# EAGLE design MCU (EAGLE 6.4)
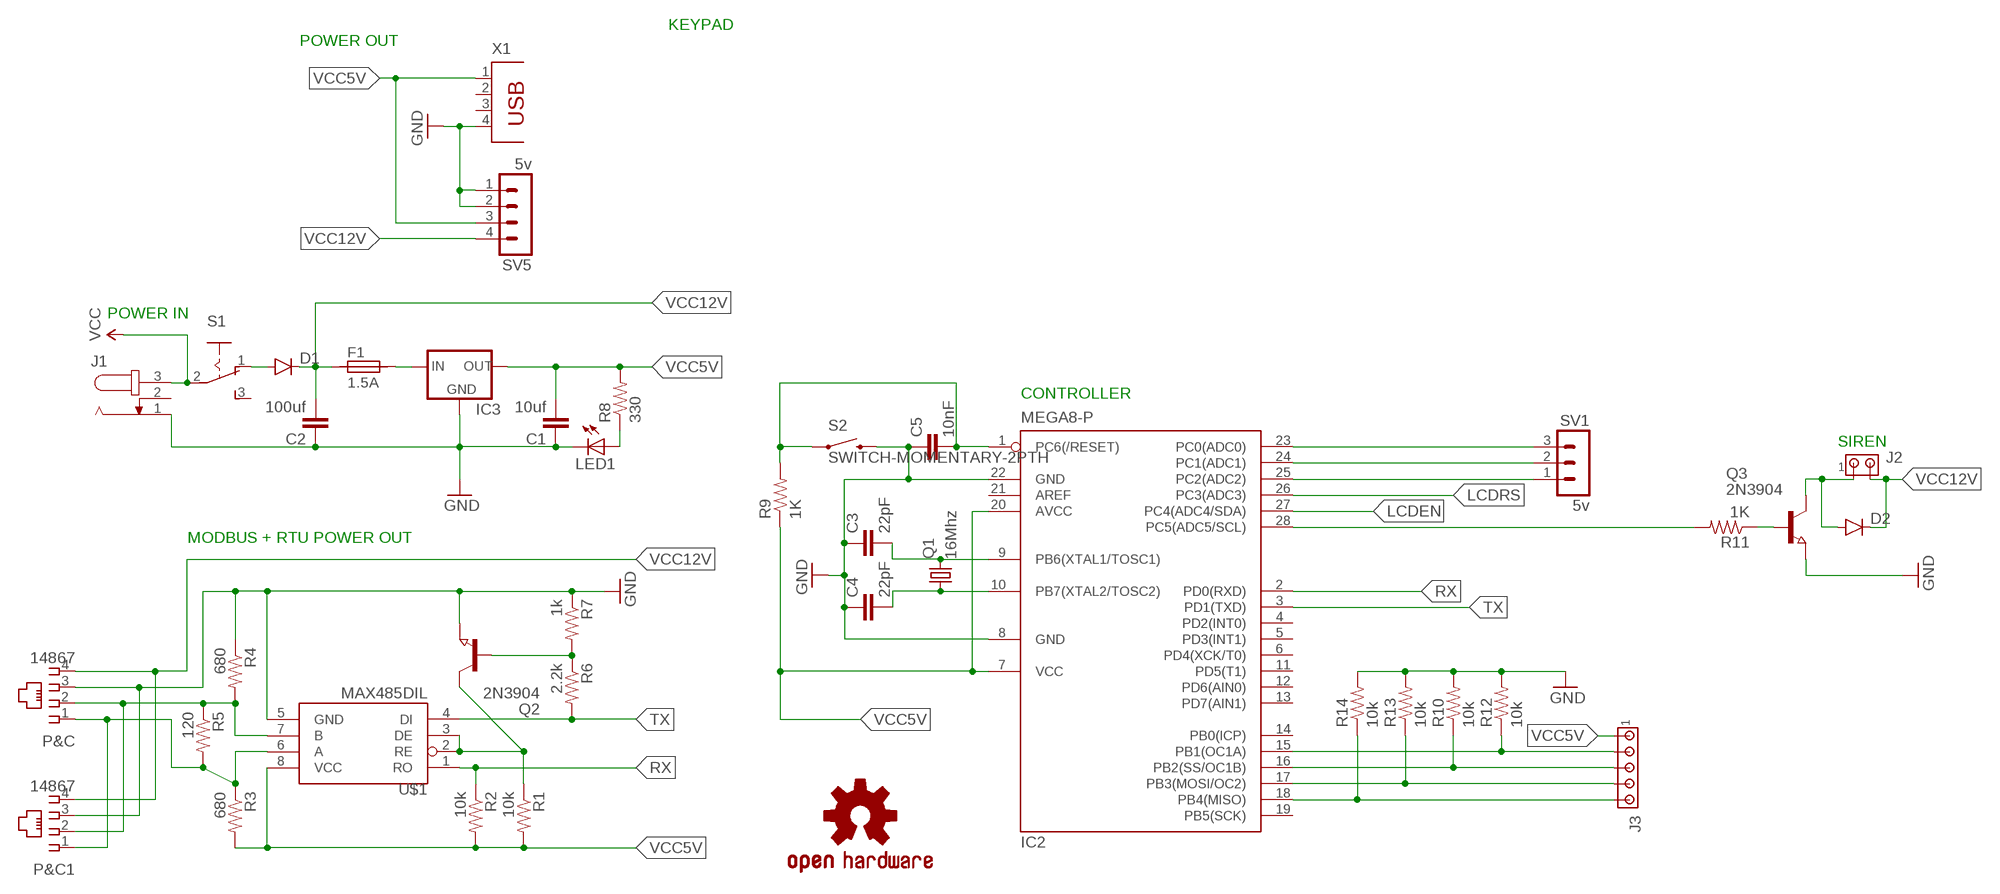
[diagram p0: schematic, sheet 1]

## Parts
C1  10uf  CAP0805  [0805]
C2  100uf  CAP0805  [0805]
C3  22pF  CAP0805  [0805]
C4  22pF  CAP0805  [0805]
C5  10nF  CAP0805  [0805]
D1  DIODESMA  [SMA-DIODE]
D2  DIODESMA  [SMA-DIODE]
F1  1.5A  SIBA194600  [1820]
IC2  MEGA8-P  [DIL28-3]
IC3  V_REG_78XX-TO-220  [TO-220-ALT]
J1  JACK-PLUG1  [SPC4078]
J2  MTA02-156  [1X2MTA]
J3  MTA05-156  [1X5MTA]
LED1  LEDCHIP-LED0805  [CHIP-LED0805]
LOGO1  OSHW-LOGOL  [OSHW-LOGO-L]
P&C  14867  [14867]
P&C1  14867  [14867]
Q1  16Mhz  CRYSTALSM49  [SM49]
Q2  2N3904  NPN-TRANSISTOR_SOT23  [SOT23]
Q3  2N3904  NPN-TRANSISTOR_SOT23  [SOT23]
R1  10k  RESISTOR0805-RES  [0805]
R2  10k  RESISTOR0805-RES  [0805]
R3  680  RESISTOR0805-RES  [0805]
R4  680  RESISTOR0805-RES  [0805]
R5  120  RESISTOR0805-RES  [0805]
R6  2.2k  RESISTOR0805-RES  [0805]
R7  1k  RESISTOR0805-RES  [0805]
R8  330  RESISTOR0805-RES  [0805]
R9  1K  RESISTOR0805-RES  [0805]
R10  10k  RESISTOR0805-RES  [0805]
R11  1K  RESISTOR0805-RES  [0805]
R12  10k  RESISTOR0805-RES  [0805]
R13  10k  RESISTOR0805-RES  [0805]
R14  10k  RESISTOR0805-RES  [0805]
S1  255SB  [255SB]
S2  SWITCH-MOMENTARY-2PTH  [TACTILE-PTH]
SV1  5v  MA03-1  [MA03-1]
SV5  5v  MA04-1  [MA04-1]
U$1  MAX485DIL  [DIL08]
X1  PN87520  [PN87520]

## Nets
GND: C1.1 C2.1 C3.1 C4.1 C5.1 IC2.8(GND) IC2.22(GND) IC3.GND J1.1 LED1.C P&C1.3 P&C.3 Q2.2(E) Q3.2(E) R4.1 R7.1 R10.2 R12.2 R13.2 R14.2 S2.3 SV5.1 SV5.2 U$1.5(GND) X1.4
LCDEN: IC2.27(PC4(ADC4/SDA))
LCDRS: IC2.26(PC3(ADC3))
N$1: F1.2 IC3.IN
N$2: Q2.3(C) R1.1 U$1.2(RE) U$1.3(DE)
N$4: Q2.1(B) R6.1 R7.2
N$5: D2.A J2.1 Q3.3(C)
N$6: Q3.1(B) R11.1
N$7: P&C1.2 P&C.2 R4.2 R5.1 U$1.7(B)
N$8: P&C1.1 P&C.1 R3.1 R5.2 U$1.6(A)
N$9: IC2.28(PC5(ADC5/SCL)) R11.2
N$11: LED1.A R8.1
N$13: D1.A S1.1(O)
N$15: IC2.25(PC2(ADC2)) SV1.1
N$16: IC2.24(PC1(ADC1)) SV1.2
N$17: IC2.23(PC0(ADC0)) SV1.3
N$18: IC2.15(PB1(OC1A)) J3.2 R12.1
N$19: IC2.16(PB2(SS/OC1B)) J3.3 R10.1
N$20: IC2.17(PB3(MOSI/OC2)) J3.4 R13.1
N$21: C3.2 IC2.9(PB6(XTAL1/TOSC1)) Q1.2
N$22: IC2.18(PB4(MISO)) J3.5 R14.1
N$23: C4.2 IC2.10(PB7(XTAL2/TOSC2)) Q1.1
N$24: C5.2 IC2.1(PC6(/RESET)) R9.2 S2.1
RX: IC2.2(PD0(RXD)) R2.1 U$1.1(RO)
TX: IC2.3(PD1(TXD)) R6.2 U$1.4(DI)
VCC: J1.3 S1.2(P)
VCC5V: C1.2 IC2.7(VCC) IC2.20(AVCC) IC3.OUT J3.1 R1.2 R2.2 R3.2 R8.2 R9.1 SV5.3 U$1.8(VCC) X1.1
VCC12V: C2.2 D1.C D2.C F1.1 J2.2 P&C1.4 P&C.4 SV5.4
Unconnected: IC2.4(PD2(INT0)) IC2.5(PD3(INT1)) IC2.6(PD4(XCK/T0)) IC2.11(PD5(T1)) IC2.12(PD6(AIN0)) IC2.13(PD7(AIN1)) IC2.14(PB0(ICP)) IC2.19(PB5(SCK)) IC2.21(AREF) J1.2 S1.3(S) X1.2 X1.3

## Notes on the sheet
- KEYPAD
- POWER OUT
- POWER IN
- CONTROLLER
- SIREN
- MODBUS + RTU POWER OUT

## Library data of the parts
C1-C5 = SparkFun-Capacitors:CAP: Capacitor Standard 0603 ceramic capacitor, and 0.1" leaded capacitor.
D1 D2 = SparkFun-DiscreteSemi:DIODE: Diode These are standard reverse protection diodes and small signal diodes. SMA package can handle up to about 1A. SOD-323 can handle about 200mA. What the SOD-323 package when ordering, there are some mfgs out there that are 5-pin packages.
F1 = _hhn_PtcFuses_Siba_r500_Ozan:SIBA194600*: SIBA PTC-Fuses, Series 194600, 1812 (4.5 3.2)mm Source: www.siba.de/ Package: SMD 1812 (4.5 x 3.2)mm Technologies: SIBA194600Axxx xxx: Trip-Current * 10 mA Author: Dipl.-Ing. FH Rainer Bayer
IC2 = atmel:MEGA8-P: MICROCONTROLLER 8 Kbytes FLASH, 1 kbytes SRAM, 512 bytes EEPROM, USART, 4-channel 10 bit ADC, 2-channel 8 bit ADC Pin compatible with Atmega48, ATMega88, ATMega168 Source: avr.lbr; OC_FARNELL: unknown; OC_NEWARK: unknown
IC3 = SparkFun-PowerIC:V_REG_78XX: Voltage Regulator Standard 7805 5V regulator. IGO (Input Ground Output). Spark Fun Electronics SKU : COM-00107
J1 = con-jack:JACK-PLUG: DC POWER JACK Power Jack, DC, Right Angle, Through Hole, Rated 5A at 16VDC, PC Terminals Distributor: Farnell (www.Farnell.de) Drawing: 84N1161.pdf / 84N1162.pdf Manufacturer: SPC Technology (www.spctechnology.com) Type: SPC4077 / SPC 4078; OC_FARNELL: unknown; OC_NEWARK: unknown
J2 = con-amp:MTA02-156: AMP connector
J3 = con-amp:MTA05-156: AMP connector
LED1 = led:LED: LED OSRAM: - CHIPLED LG R971, LG N971, LY N971, LG Q971, LY Q971, LO R971, LY R971 LH N974, LH R974 LS Q976, LO Q976, LY Q976 LO Q996 - Hyper CHIPLED LW Q18S LB Q993, LB Q99A, LB R99A - SideLED LS A670, LO A670, LY A670, LG A670, LP A670 LB A673, LV A673, LT A673, LW A673 LH A674 LY A675 LS A676, LA A676, LO A676, LY A676, LW A676 LS A679, LY A679, LG A679 - Hyper Micro SIDELED® LS Y876, LA Y876, LO Y876, LY Y876 LT Y87S - SmartLED LW L88C, LW L88S LB L89C, LB L89S, LG L890 LS L89K, LO L89K, LY L89K LS L896, LA L896, LO L896, LY L896 - TOPLED LS T670, LO T670, LY T670, LG T670, LP T670 LSG T670, LSP T670, LSY T670, LOP T670, LYG T670 LG T671, LOG T671, LSG T671 LB T673, LV T673, LT T673, LW T673 LH T674 LS T676, LA T676, LO T676, LY T676, LB T676, LH T676, LSB T676, LW T676 LB T67C, LV T67C, LT T67C, LS T67K, LO T67K, LY T67K, LW E67C LS E67B, LA E67B, LO E67B, LY E67B, LB E67C, LV E67C, LT E67C LW T67C LS T679, LY T679, LG T679 LS T770, LO T770, LY T770, LG T770, LP T770 LB T773, LV T773, LT T773, LW T773 LH T774 LS E675, LA E675, LY E675, LS T675 LS T776, LA T776, LO T776, LY T776, LB T776 LHGB T686 LT T68C, LB T68C - Hyper Mini TOPLED® LB M676 - Mini TOPLED Santana® LG M470 LS M47K, LO M47K, LY M47K Source: http://www.osram.convergy.de LUXEON: - LUMILED® LXK2-PW12-R00, LXK2-PW12-S00, LXK2-PW14-U00, LXK2-PW14-V00 LXK2-PM12-R00, LXK2-PM12-S00, LXK2-PM14-U00 LXK2-PE12-Q00, LXK2-PE12-R00, LXK2-PE12-S00, LXK2-PE14-T00, LXK2-PE14-U00 LXK2-PB12-K00, LXK2-PB12-L00, LXK2-PB12-M00, LXK2-PB14-N00, LXK2-PB14-P00, LXK2-PB14-Q00 LXK2-PR12-L00, LXK2-PR12-M00, LXK2-PR14-Q00, LXK2-PR14-R00 LXK2-PD12-Q00, LXK2-PD12-R00, LXK2-PD12-S00 LXK2-PH12-R00, LXK2-PH12-S00 LXK2-PL12-P00, LXK2-PL12-Q00, LXK2-PL12-R00 Source: www.luxeon.com KINGBRIGHT: KA-3528ASYC Source: www.kingbright.com
LOGO1 = SparkFun-Aesthetics:OSHW-LOGO: Open Source Hardware Logo This logo indicates the piece of hardware it is found on incorporates a OSHW license and/or adheres to the definition of open source hardware found here: http://freedomdefined.org/OSHW
P&C P&C1 = con-4ucon:14867: RJ11 Connector Source: 4UCON TECHNOLOGY INC. 14867.pdf; OC_FARNELL: unknown; OC_NEWARK: unknown
Q1 = crystal:CRYSTAL: CRYSTAL; OC_FARNELL: unknown; OC_NEWARK: unknown
Q2 Q3 = semicon-smd-ipc:NPN-TRANSISTOR_: NPN TRANSISTOR
R1-R14 = SparkFun-Passives:RESISTOR: Resistor Basic schematic elements and footprints for 0603, 1206, and PTH resistors.
S1 = switch:255SB: SLIDING SWITCH Distributor Buerklin, 11G810
S2 = SparkFun-Electromechanical:SWITCH-MOMENTARY-2: Various NO switches- pushbuttons, reed, etc
SV1 = con-lstb:MA03-1: PIN HEADER; OC_FARNELL: unknown; OC_NEWARK: unknown
SV5 = con-lstb:MA04-1: PIN HEADER; OC_FARNELL: unknown; OC_NEWARK: unknown
U$1 = SparkFun-DigitalIC:MAX485: RS-485 transceiver
X1 = con-berg:PN87520: BERG USB connector; OC_FARNELL: unknown; OC_NEWARK: unknown

## Net classes
0 default: width 0.3 mm, drill 0.5 mm, clearance 0.25 mm

## Board
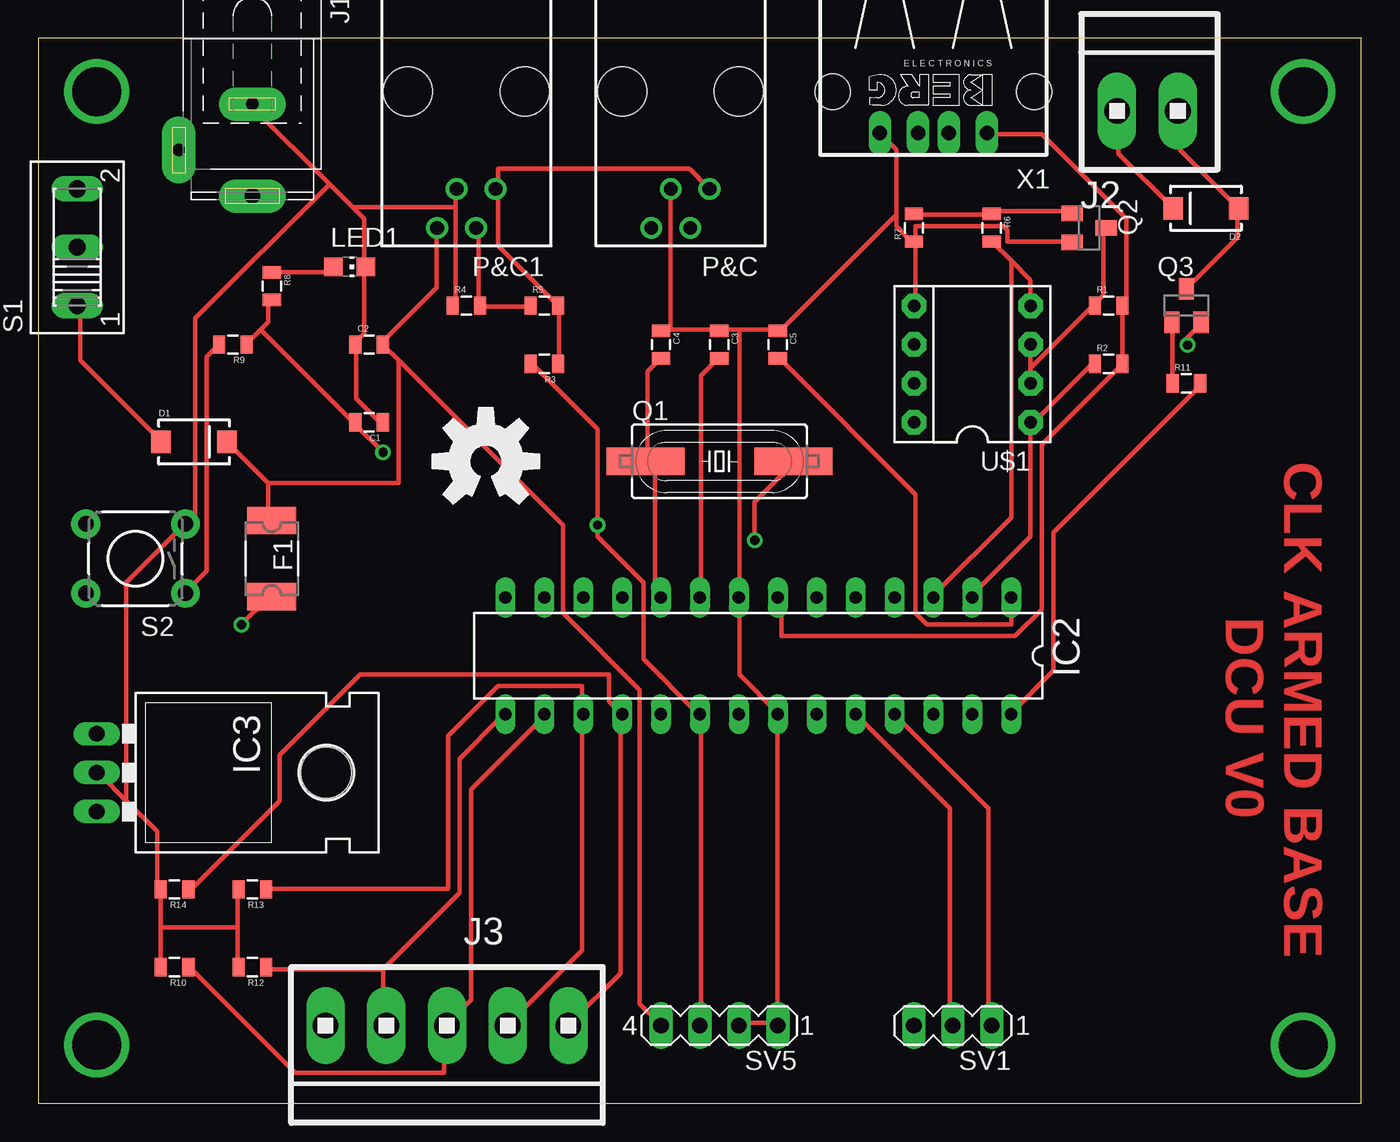
[diagram p1: board, top side]
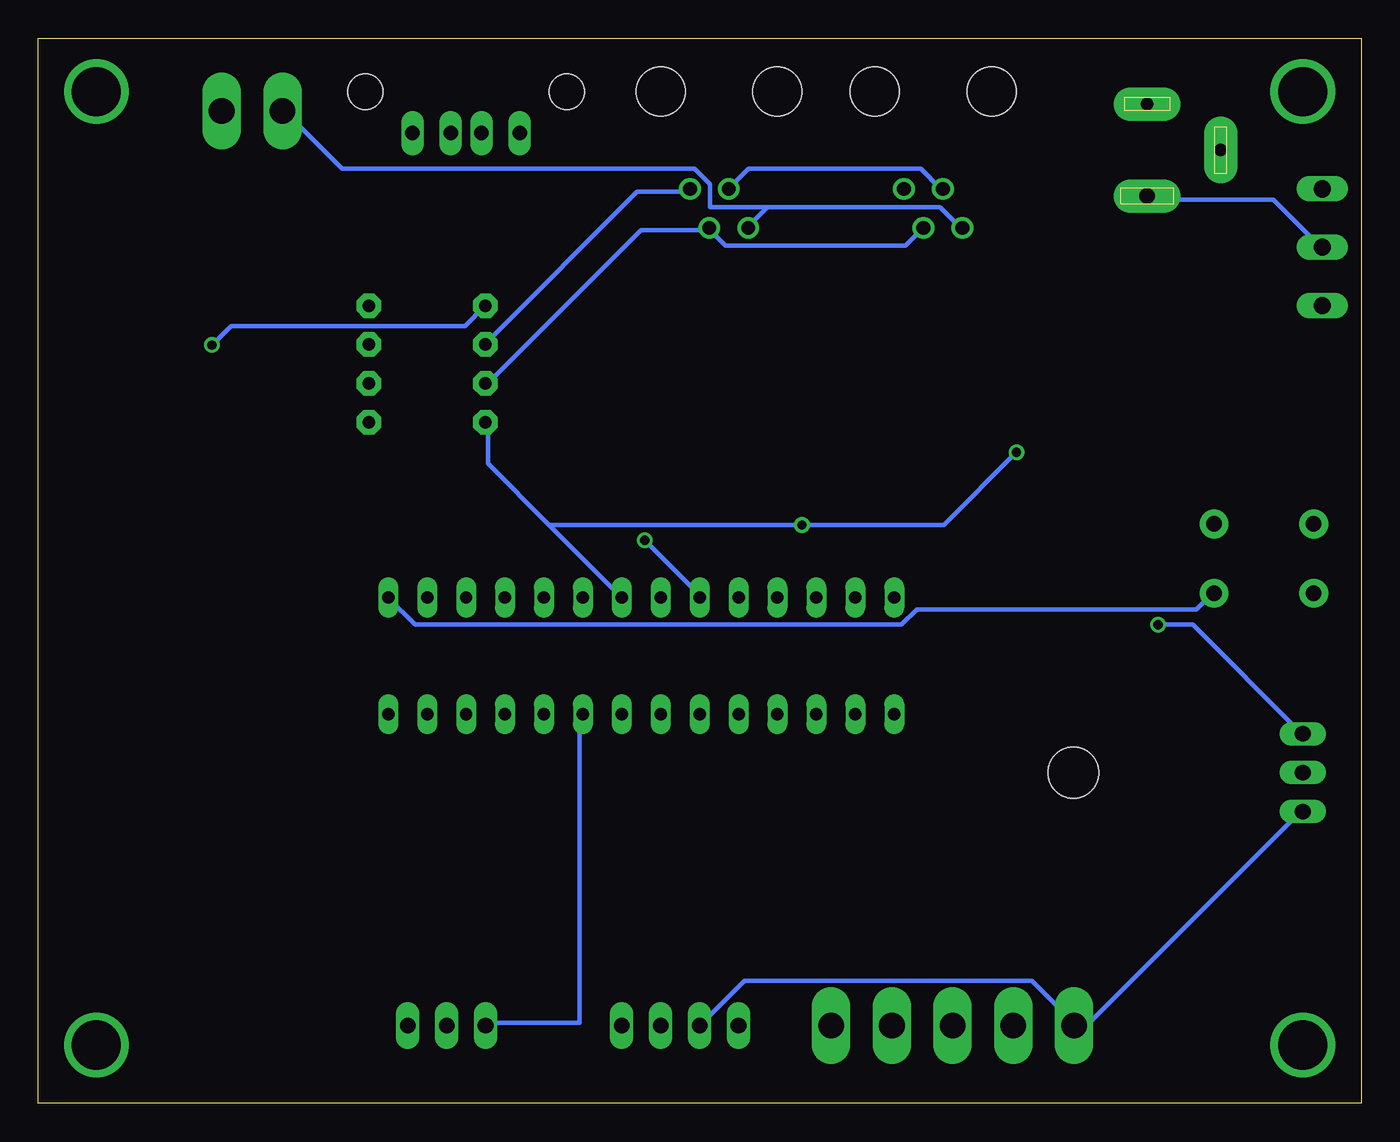
[diagram p2: board, bottom side, seen from below]

Size 86.34 x 69.52 mm. Coordinates in mm from the lower left corner, seen from the top.
Outline: 0,0 86.34,0 86.34,69.52 0,69.52 0,0
Copper layers (1*16): Top 0.035mm / dielectric 1.5mm / Bottom 0.035mm
Design rules "default": minimum track width 10mil, minimum drill 24mil, track to track 8mil, track to pad 8mil, pad to pad 8mil, via to via 8mil, smd to smd 8mil, copper to edge 40mil, drill to drill 8mil, minimum pad ring 10mil, minimum via ring 8mil, stop-mask expansion 4mil, vias tented up to drill 0mil, thermal gap 10mil

### Footprints (pad centres in the part's own frame; a part is rotated, then mirrored left to right if it is on the bottom)
0805 = smd 0.8 x 1.2: 1 -0.9,0; 2 0.9,0
SMA-DIODE = smd 1.27 x 1.47: A -2.15,0; C 2.15,0
1820 = smd 1.78 x 3.2: 1 -2.49,0; 2 2.49,0
DIL28-3 = drill 0.813 long: 1 -16.51,-3.81; 2 -13.97,-3.81; 3 -11.43,-3.81; 4 -8.89,-3.81; 5 -6.35,-3.81; 6 -3.81,-3.81; 7 -1.27,-3.81; 8 1.27,-3.81; 9 3.81,-3.81; 10 6.35,-3.81; 11 8.89,-3.81; 12 11.43,-3.81; 13 13.97,-3.81; 14 16.51,-3.81; 15 16.51,3.81; 16 13.97,3.81; 17 11.43,3.81; 18 8.89,3.81; 19 6.35,3.81; 20 3.81,3.81; 21 1.27,3.81; 22 -1.27,3.81; 23 -3.81,3.81; 24 -6.35,3.81; 25 -8.89,3.81; 26 -11.43,3.81; 27 -13.97,3.81; 28 -16.51,3.81
TO-220-ALT = drill 1.016 long: GND 0,-3.81; IN -2.54,-3.81; OUT 2.54,-3.81 | hole 3.302: 0,11.176
SPC4078 = drill 0.8 pad 2.184 long: 1 -3,0; 2 0,-4.8 | drill 1 pad 2.184 long: 3 3,0
1X2MTA = drill 1.676 long: 1 1.981,0; 2 -1.981,0
1X5MTA = drill 1.676 long: 1 7.925,0; 2 3.962,0; 3 0,0; 4 -3.962,0; 5 -7.925,0
CHIP-LED0805 = smd 1.2 x 1.2: A 0,-1.05; C 0,1.05
14867 = drill 0.9 pad 1.422: 1 -1.905,6.35; 2 -0.635,8.89; 3 0.635,6.35; 4 1.905,8.89 | hole 3.2: -3.81,0; 3.81,0
SM49 = smd 5.08 x 1.778: 1 -4.826,0; 2 4.826,0
SOT23 = smd 1 x 1.4: 1 -0.95,-1.1; 2 0.95,-1.1; 3 0,1.1
255SB = drill 1.118 long: 1 -3.81,0; 2 0,0; 3 3.81,0
TACTILE-PTH = drill 1.016 pad 1.88: 1 -3.251,2.261; 2 3.251,2.261; 3 -3.251,-2.261; 4 3.251,-2.261
MA03-1 = drill 1.016 long: 1 -2.54,0; 2 0,0; 3 2.54,0
MA04-1 = drill 1.016 long: 1 -3.81,0; 2 -1.27,0; 3 1.27,0; 4 3.81,0
DIL08 = drill 0.813 pad 1.6 octagon: 1 -3.81,-3.81; 2 -1.27,-3.81; 3 1.27,-3.81; 4 3.81,-3.81; 5 3.81,3.81; 6 1.27,3.81; 7 -1.27,3.81; 8 -3.81,3.81
PN87520 = drill 0.95 long: 1 -3.5,2.71; 2 -1,2.71; 3 1,2.71; 4 3.5,2.71 | hole 2.3: -6.57,0; 6.57,0

### Placement (x,y rotation side)
C1  21.59,44.45 180 top
C2  21.59,49.53 0 top
C3  44.45,49.53 270 top
C4  40.64,49.53 270 top
C5  48.26,49.53 270 top
D1  10.16,43.18 0 top
D2  76.2,58.42 180 top
F1  15.24,35.56 270 top
IC2  46.99,29.21 180 top
IC3  7.62,21.59 270 top
J1  13.97,62.23 270 top
J2  72.39,64.77 0 top
J3  26.67,5.08 180 top
LED1  20.32,54.61 270 top
LOGO1  29.21,41.91 0 top
P&C  41.91,66.04 180 top
P&C1  27.94,66.04 180 top
Q1  44.45,41.91 0 top
Q2  68.58,57.15 270 top
Q3  74.93,52.07 0 top
R1  69.85,52.07 0 top
R2  69.85,48.26 0 top
R3  33.02,48.26 180 top
R4  27.94,52.07 0 top
R5  33.02,52.07 0 top
R6  62.23,57.15 270 top
R7  57.15,57.15 90 top
R8  15.24,53.34 270 top
R9  12.7,49.53 180 top
R10  8.89,8.89 180 top
R11  74.93,46.99 0 top
R12  13.97,8.89 180 top
R13  13.97,13.97 180 top
R14  8.89,13.97 180 top
S1  2.54,55.88 90 top
S2  6.35,35.56 180 top
SV1  59.69,5.08 180 top
SV5  44.45,5.08 180 top
U$1  60.96,48.26 90 top
X1  58.42,66.04 180 top

### Tracks (layer width: path | path; a pad name or v marks a point on that pad's centre or on a via)
GND  (via drill 0.61)
  Top 0.3: 8,11.5 8,13.75 R14.2 7.75,14 7.75,17.75 5.75,19.75 | 8,11.5 8,9 R10.2 | 13,11.5 13,13.75 R13.2 | 13,11.5 13,9 R12.2 | 13,11.5 8,11.5 | 5.75,19.75 4,21.5 IC3.GND | 5.75,19.75 5.75,34 9.5,37.75 S2.3 9.75,38 10.25,38.5 10.25,51.25 19,60 | 27.25,58.5 27.25,59.5 P&C1.3 | 27.25,58.5 27.25,52.25 R4.1 | C1.1 22.25,44.5 20.75,46 20.75,49.5 C2.1 20.75,49.75 21.25,50.25 21.25,54.5 LED1.C 21.25,54.75 21.25,57.75 20.5,58.5 | 20.5,58.5 19,60 | 19,60 14,65 J1.1 | 20.5,58.5 27.25,58.5 | 48.25,5.25 45.75,5.25 SV5.2 | 48.25,5.25 48.25,25.25 IC2.22 48.25,25.5 45.75,28 45.75,33 IC2.8 45.75,33.25 45.75,50.5 | 48.25,5.25 SV5.1 | 41.25,50.5 44.25,50.5 C3.1 44.5,50.5 45.75,50.5 | 41.25,50.5 40.75,50.5 C4.1 | 45.75,50.5 48.25,50.5 C5.1 48.5,50.5 56,58 | 41.25,50.5 41.25,59.5 P&C.3 | 57.25,56.25 57.25,52.25 U$1.5 | 57.25,56.25 57.25,57.25 63,57.25 63.25,57 63.25,56.25 67.25,56.25 Q2.2 | 57.25,56.25 R7.1 57,56.25 56,57.25 56,58 | v75,49.5 75,50 75.75,50.75 Q3.2 | X1.4 56,62.25 56,58
  Bottom 0.3: v75,49.5 73.75,50.75 58.5,50.75 57.25,52 U$1.5 | P&C1.3 27.5,59.75 28.75,61 40,61 41.25,59.75 P&C.3
N$1  (via drill 0.61)
  Top 0.3: v13.25,31.25 15,33 F1.2
  Bottom 0.3: v13.25,31.25 11,31.25 4,24.25 IC3.IN
N$2
  Top 0.3: Q2.3 69.5,57 69.5,52.75 69,52.25 R1.1 68.75,52 64.75,48 | 64.75,48 64.75,49.5 U$1.3 | 64.75,48 64.75,47 U$1.2
N$3  (via drill 3.2 pad 1.68)
  other vias: 3.81,66.04
N$4
  Top 0.3: R7.2 57.25,58 62,58 R6.1 62.25,58.25 67.25,58.25 Q2.1
N$5
  Top 0.3: Q3.3 75,53.25 78.25,56.5 78.25,58.25 D2.A 78.25,58.5 74.5,62.25 74.5,64.75 J2.1
N$6
  Top 0.3: R11.1 74,47 74,50.75 Q3.1
N$7
  Top 0.3: R5.1 32,52 29,52 R4.2 28.75,52.25 28.75,57 P&C1.2
  Bottom 0.3: P&C1.2 28.75,57 29.75,56 41.5,56 42.5,57 P&C.2 42.75,57 47,57 57,47 U$1.7
N$8
  Top 0.3: R3.1 34,48.5 34,52 R5.2 33.75,52.25 30,56 30,59.5 P&C1.1 30,59.75 30,61 42.5,61 43.75,59.75 P&C.1
  Bottom 0.3: U$1.6 57,49.75 47.25,59.5 44,59.5 P&C.1
N$9
  Top 0.3: R11.2 75.75,46.75 66.25,37.25 66.25,28.25 63.5,25.5 IC2.28
N$10  (via drill 3.2 pad 1.68)
  other vias: 3.81,3.81
N$11
  Top 0.3: R8.1 19.25,54.25 19.25,54.5 LED1.A
N$12  (via drill 3.2 pad 1.68)
  other vias: 82.55,66.04
N$13
  Top 0.3: D1.A 8,43.25 2.75,48.5 2.75,52 S1.1
N$14  (via drill 3.2 pad 1.68)
  other vias: 82.55,3.81
N$15
  Top 0.3: IC2.25 56,25.25 62,19.25 62,5.25 SV1.1
N$16
  Top 0.3: IC2.24 53.5,25.25 59.5,19.25 59.5,5.25 SV1.2
N$17
  Bottom 0.3: IC2.23 51,25.25 51,5.25 57,5.25 SV1.3
N$18
  Top 0.3: 22.5,8.75 15,8.75 R12.1 | 22.5,8.75 22.5,5.25 J3.2 | 22.5,8.75 27.5,13.75 27.5,22.5 30.25,25.25 IC2.15
N$19
  Top 0.3: R10.1 10,8.75 16.75,2 26.5,2 26.5,5 J3.3 26.75,5.25 28.25,6.75 28.25,20.5 33,25.25 IC2.16
N$20
  Top 0.3: R13.1 15,14 26.75,14 26.75,24 30,27.25 35.5,27.25 35.5,25.5 IC2.17 35.5,25.25 35.5,10 30.75,5.25 J3.4
N$21  (via drill 0.61)
  Top 0.3: C3.2 44.25,48.5 43.25,47.5 43.25,33.25 IC2.9 | v46.75,36.75 46.75,39.25 49.25,41.75 Q1.2
  Bottom 0.3: v46.75,36.75 43.25,33.25 IC2.9
N$22
  Top 0.3: R14.1 10,14 15.75,19.75 15.75,22.75 21,28 37.25,28 37.25,26.25 IC2.18 38,25.25 38,8.5 34.75,5.25 J3.5
N$23
  Top 0.3: C4.2 40.5,48.5 39.75,47.75 39.75,42 Q1.1 39.75,41.75 40.25,41.25 40.25,33.5 40.5,33.25 IC2.10
N$24
  Top 0.3: R9.2 11.75,49.5 11,48.75 11,34.75 9.75,33.5 S2.1 | IC2.1 63.5,31.25 58,31.25 57.25,32 57.25,39.75 48.5,48.5 C5.2
  Bottom 0.3: S2.1 9.75,33.25 10.75,32.25 29,32.25 30,31.25 61.75,31.25 63.5,33 IC2.1
RX
  Top 0.3: R2.1 68.75,48.25 65,44.5 U$1.1 64.75,44.25 64.75,37 61,33.25 IC2.2
TX
  Top 0.3: 63.5,55 64.75,53.75 64.75,52.25 U$1.4 | 63.5,55 62.25,56.25 R6.2 | 63.5,55 63.5,38.25 58.5,33.25 IC2.3
VCC
  Bottom 0.3: S1.2 2.75,56 5.75,59 13.75,59 J1.3
VCC5V  (via drill 0.61)
  Top 0.3: R3.2 32.25,48.25 36.5,44 v36.5,37.75 36.5,37 39.5,34 39.5,29 43,25.5 IC2.20 43.25,25.25 43.25,5.25 SV5.3 | X1.1 62,63.25 65.5,63.25 71,57.75 71,52.5 70.75,52.25 R1.2 R2.2 65.5,43 65.5,32.25 63.75,30.5 48.5,30.5 48.5,33 IC2.7 | 14.5,50.5 15,51 15,52.25 R8.2 | 14.5,50.5 13.75,49.75 R9.1 | 14.5,50.5 20.5,44.5 C1.2 20.75,44.25 v22.5,42.5
  Bottom 0.3: IC3.OUT 4,19 17.75,5.25 18.5,5.25 J3.1 18.75,5.25 21.5,8 40.25,8 43,5.25 SV5.3 | 53,37.75 57,41.75 57,44.25 U$1.8 | 53,37.75 48.5,33.25 IC2.7 | v22.5,42.5 27.25,37.75 v36.5,37.75 53,37.75
VCC12V
  Top 0.3: D2.C 74,58.5 70.5,62 70.5,64.75 J2.2 | 15,40.5 12.5,43 D1.C | 15,40.5 15,38.25 F1.1 | P&C1.4 26,57 26,53.25 22.5,49.75 C2.2 22.5,49.5 23.5,48.5 | 23.5,48.5 34.25,37.75 34.25,32 39.25,27 39.25,6.5 40.5,5.25 SV5.4 | 15,40.5 23.5,40.5 23.5,48.5
  Bottom 0.3: 38.75,58.5 40,57.25 P&C.4 | 38.75,58.5 27.5,58.5 26.25,57.25 P&C1.4 | 38.75,58.5 42.5,58.5 42.5,60 43.5,61 66.5,61 70.25,64.75 J2.2

### Text on the board
Top: CLK ARMED BASE | DCU V0